# Altium project PCB_Project.PrjPcb
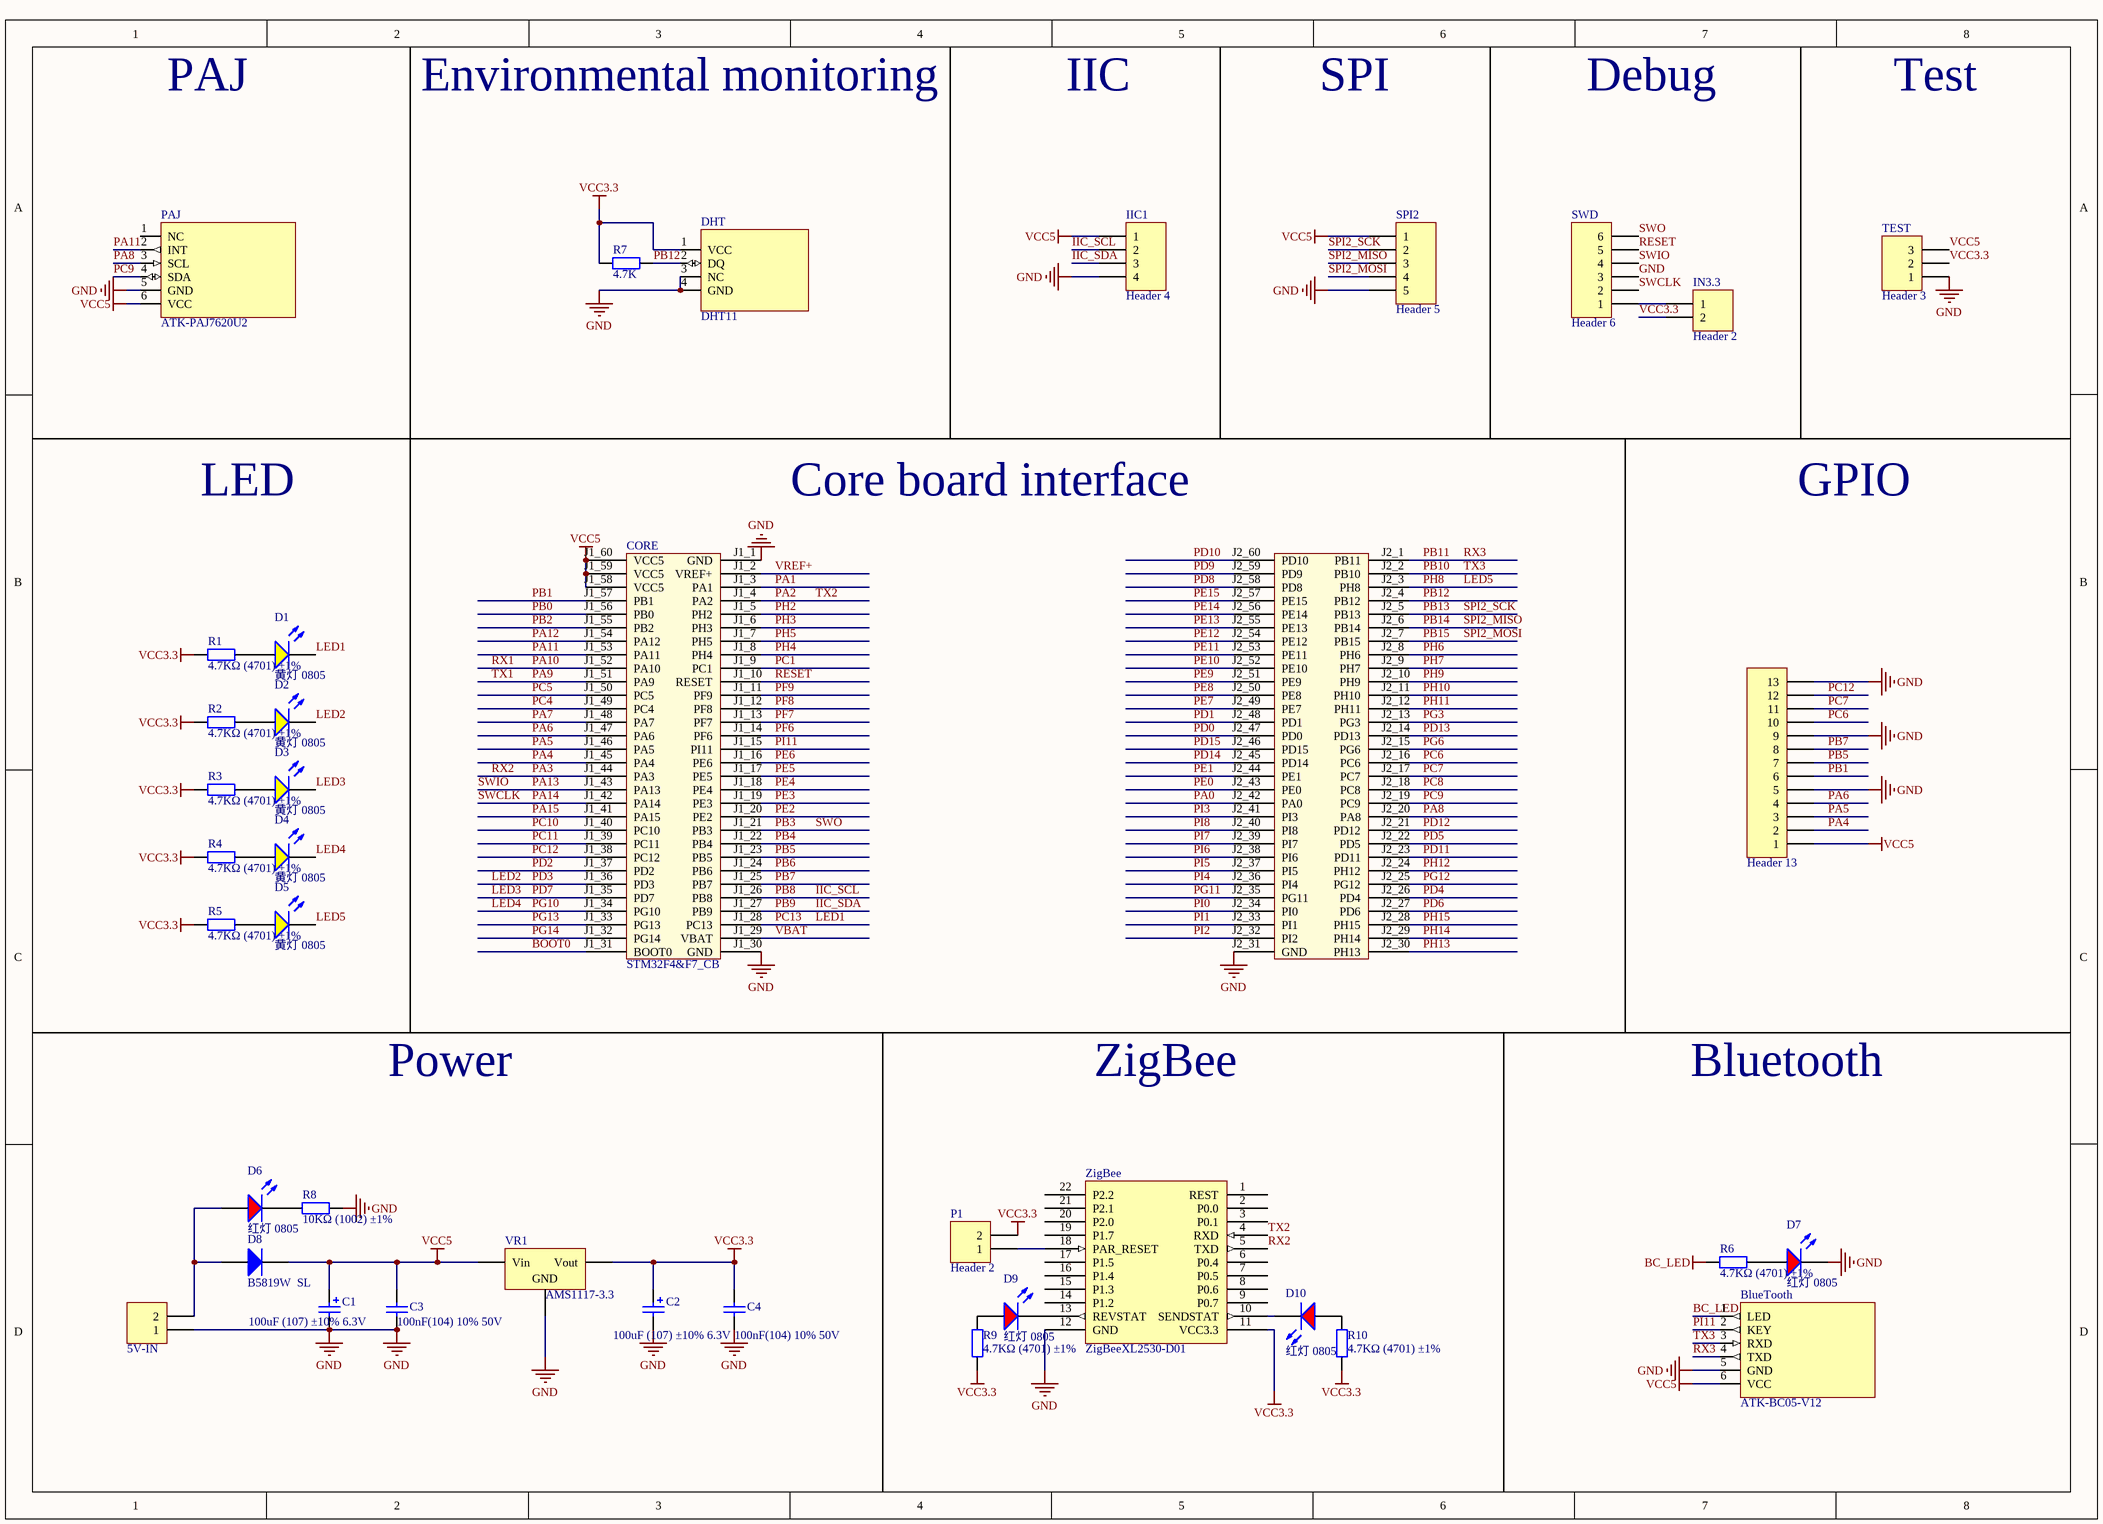
[diagram p0: core_layer.SchDoc]
1 sheet, 38 parts. Net scope: global (net labels, ports and power ports of the same name join across sheets).
Board file: core_layer.PcbDoc

## Sheet core_layer.SchDoc
size A3

### Parts
5V-IN  Header 2  [HDR2X1_A]  (value not drawn)
BlueTooth  ATK-BC05-V12  [ATK-BC05-V12]
C1  100uF (107) ±10% 6.3V  [CASE-B_3528]
C2  100uF (107) ±10% 6.3V  [CASE-B_3528]
C3  100nF(104) 10% 50V  [0805_C]
C4  100nF(104) 10% 50V  [0805_C]
CORE  STM32F4&F7_CB  [STM32F4&F7_CB]
D1  黄灯 0805  [0805_LED_S1]
D2  黄灯 0805  [0805_LED_S1]
D3  黄灯 0805  [0805_LED_S1]
D4  黄灯 0805  [0805_LED_S1]
D5  黄灯 0805  [0805_LED_S1]
D6  红灯 0805  [0805_LED_S1]
D7  红灯 0805  [0805_LED_S1]
D8  B5819W  SL  [SOD-123]
D9  红灯 0805  [0805_LED_S1]
D10  红灯 0805  [0805_LED_S1]
DHT  DHT11  [DTH11]
IIC1  Header 4  [HDR1X4]
IN3.3  Header 2  [HDR1X2]
P1  Header 2  [HDR1X2]
PAJ  ATK-PAJ7620U2  [ATK-AJ7620U2]
R1  4.7KΩ (4701) ±1%  [0805_R]
R2  4.7KΩ (4701) ±1%  [0805_R]
R3  4.7KΩ (4701) ±1%  [0805_R]
R4  4.7KΩ (4701) ±1%  [0805_R]
R5  4.7KΩ (4701) ±1%  [0805_R]
R6  4.7KΩ (4701) ±1%  [0805_R]
R7  value 4.7K  [0805-1]  (hidden comment: Res1)
R8  10KΩ (1002) ±1%  [0805_R]
R9  4.7KΩ (4701) ±1%  [0805_R]
R10  4.7KΩ (4701) ±1%  [0805_R]
SPI2  Header 5  [HDR1X5]
SWD  Header 6  [HDR1X6]
TEST  Header 3  [HDR1X3]
VR1  AMS1117-3.3  [SOT-223]
ZigBee  ZigBeeXL2530-D01  [ZigBee XL2530-D01]
  Header 13  [HDR1X13]

### Nets
BC_LED: BlueTooth.1(LED) R6.1
GND: 5V-IN.1 BlueTooth.5(GND) C1.2 C2.2 C3.2 C4.2 CORE.J1_1(GND) CORE.J1_30(GND) CORE.J2_31(GND) D7.K DHT.3(NC) DHT.4(GND) IIC1.4 PAJ.5(GND) R8.2 SPI2.5 SWD.3 TEST.1 VR1.1(GND) ZigBee.12(GND) .5 .9 .13
VCC3.3: C2.1 C4.1 DHT.1(VCC) IN3.3.2 P1.2 R1.1 R2.1 R3.1 R4.1 R5.1 R7.1 R9.1 R10.1 TEST.2 VR1.2(Vout) ZigBee.11(VCC3.3)
VCC5: BlueTooth.6(VCC) C1.1 C3.1 CORE.J1_58(VCC5) CORE.J1_59(VCC5) CORE.J1_60(VCC5) D8.2(K) IIC1.1 PAJ.6(VCC) SPI2.1 TEST.3 VR1.3(Vin) .1
BOOT0: CORE.J1_31(BOOT0)
IIC_SCL: CORE.J1_26(PB8) IIC1.2  [also labelled PB8]
IIC_SDA: CORE.J1_27(PB9) IIC1.3  [also labelled PB9]
LED1: CORE.J1_28(PC13) D1.K  [also labelled PC13]
LED2: CORE.J1_36(PD3) D2.K  [also labelled PD3]
LED3: CORE.J1_35(PD7) D3.K  [also labelled PD7]
LED4: CORE.J1_34(PG10) D4.K  [also labelled PG10]
LED5: CORE.J2_3(PH8) D5.K  [also labelled PH8]
PA0: CORE.J2_42(PA0)
PA1: CORE.J1_3(PA1)
PA2: CORE.J1_4(PA2) ZigBee.4(RXD)  [also labelled TX2]
PA3: CORE.J1_44(PA3) ZigBee.5(TXD)  [also labelled RX2]
PA4: CORE.J1_45(PA4) .2
PA5: CORE.J1_46(PA5) .3
PA6: CORE.J1_47(PA6) .4
PA7: CORE.J1_48(PA7)
PA8: CORE.J2_20(PA8) PAJ.3(SCL)
PA9: CORE.J1_51(PA9)  [also labelled TX1]
PA10: CORE.J1_52(PA10)  [also labelled RX1]
PA11: CORE.J1_53(PA11) PAJ.2(INT)
PA12: CORE.J1_54(PA12)
PA13: CORE.J1_43(PA13) SWD.4  [also labelled SWIO]
PA14: CORE.J1_42(PA14) SWD.2  [also labelled SWCLK]
PA15: CORE.J1_41(PA15)
PB0: CORE.J1_56(PB0)
PB1: CORE.J1_57(PB1) .6
PB2: CORE.J1_55(PB2)
PB3: CORE.J1_21(PB3) SWD.6  [also labelled SWO]
PB4: CORE.J1_22(PB4)
PB5: CORE.J1_23(PB5) .7
PB6: CORE.J1_24(PB6)
PB7: CORE.J1_25(PB7) .8
PB10: BlueTooth.3(RXD) CORE.J2_2(PB10)  [also labelled TX3]
PB11: BlueTooth.4(TXD) CORE.J2_1(PB11)  [also labelled RX3]
PB12: CORE.J2_4(PB12) DHT.2(DQ) R7.2
PB13: CORE.J2_5(PB13) SPI2.2  [also labelled SPI2_SCK]
PB14: CORE.J2_6(PB14) SPI2.3  [also labelled SPI2_MISO]
PB15: CORE.J2_7(PB15) SPI2.4  [also labelled SPI2_MOSI]
PC1: CORE.J1_9(PC1)
PC4: CORE.J1_49(PC4)
PC5: CORE.J1_50(PC5)
PC6: CORE.J2_16(PC6) .10
PC7: CORE.J2_17(PC7) .11
PC8: CORE.J2_18(PC8)
PC9: CORE.J2_19(PC9) PAJ.4(SDA)
PC10: CORE.J1_40(PC10)
PC11: CORE.J1_39(PC11)
PC12: CORE.J1_38(PC12) .12
PD0: CORE.J2_47(PD0)
PD1: CORE.J2_48(PD1)
PD2: CORE.J1_37(PD2)
PD4: CORE.J2_26(PD4)
PD5: CORE.J2_22(PD5)
PD6: CORE.J2_27(PD6)
PD8: CORE.J2_58(PD8)
PD9: CORE.J2_59(PD9)
PD10: CORE.J2_60(PD10)
PD11: CORE.J2_23(PD11)
PD12: CORE.J2_21(PD12)
PD13: CORE.J2_14(PD13)
PD14: CORE.J2_45(PD14)
PD15: CORE.J2_46(PD15)
PE0: CORE.J2_43(PE0)
PE1: CORE.J2_44(PE1)
PE2: CORE.J1_20(PE2)
PE3: CORE.J1_19(PE3)
PE4: CORE.J1_18(PE4)
PE5: CORE.J1_17(PE5)
PE6: CORE.J1_16(PE6)
PE7: CORE.J2_49(PE7)
PE8: CORE.J2_50(PE8)
PE9: CORE.J2_51(PE9)
PE10: CORE.J2_52(PE10)
PE11: CORE.J2_53(PE11)
PE12: CORE.J2_54(PE12)
PE13: CORE.J2_55(PE13)
PE14: CORE.J2_56(PE14)
PE15: CORE.J2_57(PE15)
PF6: CORE.J1_14(PF6)
PF7: CORE.J1_13(PF7)
PF8: CORE.J1_12(PF8)
PF9: CORE.J1_11(PF9)
PG3: CORE.J2_13(PG3)
PG6: CORE.J2_15(PG6)
PG11: CORE.J2_35(PG11)
PG12: CORE.J2_25(PG12)
PG13: CORE.J1_33(PG13)
PG14: CORE.J1_32(PG14)
PH2: CORE.J1_5(PH2)
PH3: CORE.J1_6(PH3)
PH4: CORE.J1_8(PH4)
PH5: CORE.J1_7(PH5)
PH6: CORE.J2_8(PH6)
PH7: CORE.J2_9(PH7)
PH9: CORE.J2_10(PH9)
PH10: CORE.J2_11(PH10)
PH11: CORE.J2_12(PH11)
PH12: CORE.J2_24(PH12)
PH13: CORE.J2_30(PH13)
PH14: CORE.J2_29(PH14)
PH15: CORE.J2_28(PH15)
PI0: CORE.J2_34(PI0)
PI1: CORE.J2_33(PI1)
PI2: CORE.J2_32(PI2)
PI3: CORE.J2_41(PI3)
PI4: CORE.J2_36(PI4)
PI5: CORE.J2_37(PI5)
PI6: CORE.J2_38(PI6)
PI7: CORE.J2_39(PI7)
PI8: CORE.J2_40(PI8)
PI11: BlueTooth.2(KEY) CORE.J1_15(PI11)
RESET: CORE.J1_10(RESET) SWD.5
VBAT: CORE.J1_29(VBAT)
VREF+: CORE.J1_2(VREF+)
Net5V-IN_2: 5V-IN.2 D6.A D8.1(A)
NetD1_A: D1.A R1.2
NetD2_A: D2.A R2.2
NetD3_A: D3.A R3.2
NetD4_A: D4.A R4.2
NetD5_A: D5.A R5.2
NetD6_K: D6.K R8.1
NetD7_A: D7.A R6.2
NetD9_A: D9.A R9.2
NetD9_K: D9.K ZigBee.13(REVSTAT)
NetD10_A: D10.A R10.2
NetD10_K: D10.K ZigBee.10(SENDSTAT)
NetIN3.3_1: IN3.3.1 SWD.1
NetP1_1: P1.1 ZigBee.18(PAR_RESET)

Not connected (* = marked no-connect by the designer): PAJ 1(NC); ZigBee 1(REST) 2(P0.0) 3(P0.1) 6(P0.4) 7(P0.5) 8(P0.6) 9(P0.7) 14(P1.2) 15(P1.3) 16(P1.4) 17(P1.5) 19(P1.7) 20(P2.0) 21(P2.1) 22(P2.2)

### Notes on the sheet
- PAJ
- Environmental monitoring
- IIC
- SPI
- Debug
- Test
- LED
- Core board interface
- GPIO
- Power
- ZigBee
- Bluetooth

### Library data of the parts
5V-IN = Header 2: 接插件; LatestRevisionDate: 17-Jul-2002; LatestRevisionNote: Re-released for DXP Platform.; Publisher: Altium Limited
C1 C2 = 3528 100uF (107) 10% 6.3V: 钽电容; ComponentLink1Description: 供应商链接; ComponentLink1URL: http://www.szlcsc.com/product/details_16815.html; Package: 3528; Supplier: LC; SuppliersPartNumber: C16133
C3 C4 = 0805 100nF(104) 10% 50V: 贴片电容; ComponentLink1Description: 供应商链接; ComponentLink1URL: http://www.szlcsc.com/product/details_50686.html; Package: 0805; Supplier: LC; SuppliersPartNumber: C49678
CORE = STM32F4&F7_CB: F429/746 Core Board
D1-D5 = 0805 黄灯: 发光二极管; ComponentLink1Description: 供应商链接; ComponentLink1URL: http://www.szlcsc.com/product/details_2669.html; Package: 0805; Supplier: LC; SuppliersPartNumber: C2296
D6 D7 D9 D10 = 0805 红灯: 发光二极管; ComponentLink1Description: 供应商链接; ComponentLink1URL: http://www.szlcsc.com/product/details_2668.html; Package: 0805; Supplier: LC; SuppliersPartNumber: C2295
D8 = SOD-123 B5819W  SL: 肖特基二极管; ComponentLink1Description: 供应商链接; ComponentLink1URL: http://www.szlcsc.com/product/details_9093.html; Package: SOD-123; Supplier: LC; SuppliersPartNumber: C8598
IIC1 = Header 4: Header, 4-Pin; LatestRevisionDate: 17-Jul-2002; LatestRevisionNote: Re-released for DXP Platform.; Publisher: Altium Limited
IN3.3 P1 = Header 2: Header, 2-Pin; LatestRevisionDate: 17-Jul-2002; LatestRevisionNote: Re-released for DXP Platform.; Publisher: Altium Limited
R1-R6 R9 R10 = 0805 4.7KΩ (4701) 1%: 贴片电阻; ComponentLink1Description: 供应商链接; ComponentLink1URL: http://www.szlcsc.com/product/details_18361.html; Package: 0805; Supplier: LC; SuppliersPartNumber: C17673
R7 = Res1: 贴片电阻; Published: 8-Jun-2000; LatestRevisionDate: 17-Jul-2002; LatestRevisionNote: Re-released for DXP Platform.; PackageReference: AXIAL-0.4; Publisher: Altium Limited
R8 = 0805 10KΩ (1002) 1%: 贴片电阻; ComponentLink1Description: 供应商链接; ComponentLink1URL: http://www.szlcsc.com/product/details_18102.html; Package: 0805; Supplier: LC; SuppliersPartNumber: C17414
SPI2 = Header 5: Header, 5-Pin; LatestRevisionDate: 17-Jul-2002; LatestRevisionNote: Re-released for DXP Platform.; Publisher: Altium Limited
SWD = Header 6: Header, 6-Pin; LatestRevisionDate: 17-Jul-2002; LatestRevisionNote: Re-released for DXP Platform.; Publisher: Altium Limited
TEST = Header 3: Header, 3-Pin; LatestRevisionDate: 17-Jul-2002; LatestRevisionNote: Re-released for DXP Platform.; Publisher: Altium Limited
VR1 = SOT-223 AMS1117-3.3: 低压差线性稳压(LDO); ComponentLink1Description: 供应商链接; ComponentLink1URL: http://www.szlcsc.com/product/details_6652.html; Package: SOT-223; Supplier: LC; SuppliersPartNumber: C6186
 = Header 13: Header, 13-Pin